# Altium schematic sheet FAAFR.SchDoc
size A4
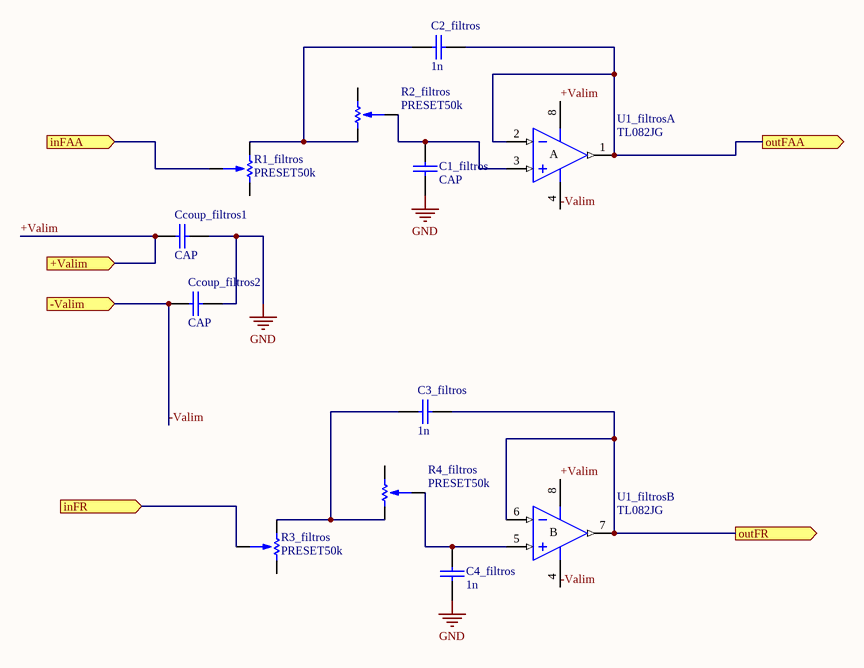
[diagram p0: FAAFR.SchDoc]

## Parts
C1_filtros  CAP  [CAP200]
C2_filtros  1n  [CAP200]
C3_filtros  1n  [CAP200]
C4_filtros  1n  [CAP200]
Ccoup_filtros1  CAP  [CAP200]
Ccoup_filtros2  CAP  [CAP200]
R1_filtros  PRESET50k  [PRESET V]
R2_filtros  PRESET50k  [PRESET V]
R3_filtros  PRESET50k  [PRESET V]
R4_filtros  PRESET50k  [PRESET V]
U1_filtros  TL082JG  [JG008]  (parts A,B of 2)

## Ports
+Valim (in), -Valim (in), inFAA (in), inFR (in), outFAA (out), outFR (out)

## Nets
GND: C1_filtros.2 C4_filtros.1 Ccoup_filtros1.2 Ccoup_filtros2.2
+Valim: Ccoup_filtros1.1 U1_filtros.8(V+) ; port +Valim
-Valim: Ccoup_filtros2.1 U1_filtros.4(V-) ; port -Valim
inFAA: R1_filtros.2 ; port inFAA
inFR: R3_filtros.2 ; port inFR
outFAA: C2_filtros.2 U1_filtros.1(OUT) U1_filtros.2(IN-) ; port outFAA
outFR: C3_filtros.2 U1_filtros.6(IN-) U1_filtros.7(OUT) ; port outFR
NetC1_filtros_1: C1_filtros.1 R2_filtros.2 U1_filtros.3(IN+)
NetC2_filtros_1: C2_filtros.1 R1_filtros.3 R2_filtros.3
NetC3_filtros_1: C3_filtros.1 R3_filtros.3 R4_filtros.3
NetC4_filtros_2: C4_filtros.2 R4_filtros.2 U1_filtros.5(IN+)

Not connected (* = marked no-connect by the designer): R1_filtros 1; R2_filtros 1; R3_filtros 1; R4_filtros 1

## Notes on the sheet
- (in symbol TL082JG, part A) A
- (in symbol TL082JG, part B) B

## Library data of the parts
C2_filtros C3_filtros C4_filtros = CAP
R1_filtros R2_filtros R3_filtros R4_filtros = PRESET
U1_filtros = TL082JG: JFET-Input Operational Amplifier; Published: 16-Jan-2001; LatestRevisionDate: 04-Mar-2005; LatestRevisionNote: Stylized 3D Model Added.; DatasheetVersion: Feb-1999; PackageVersion: Jan-1995; PackageReference: JG008; Publisher: Altium Limited; PackageDescription: DIP; 8 Leads; Row Spacing 7.62 mm; Pitch 2.54 mm; ComponentLink1Description: Manufacturer Link; ComponentLink1URL: http://www.ti.com/; ComponentLink2Description: Datasheet; ComponentLink2URL: http://www-s.ti.com/sc/ds/tl082.pdf